# Altium schematic sheet p1_control_block_mcu.SchDoc
size A1; SheetNumber: 1; SheetTotal: 1
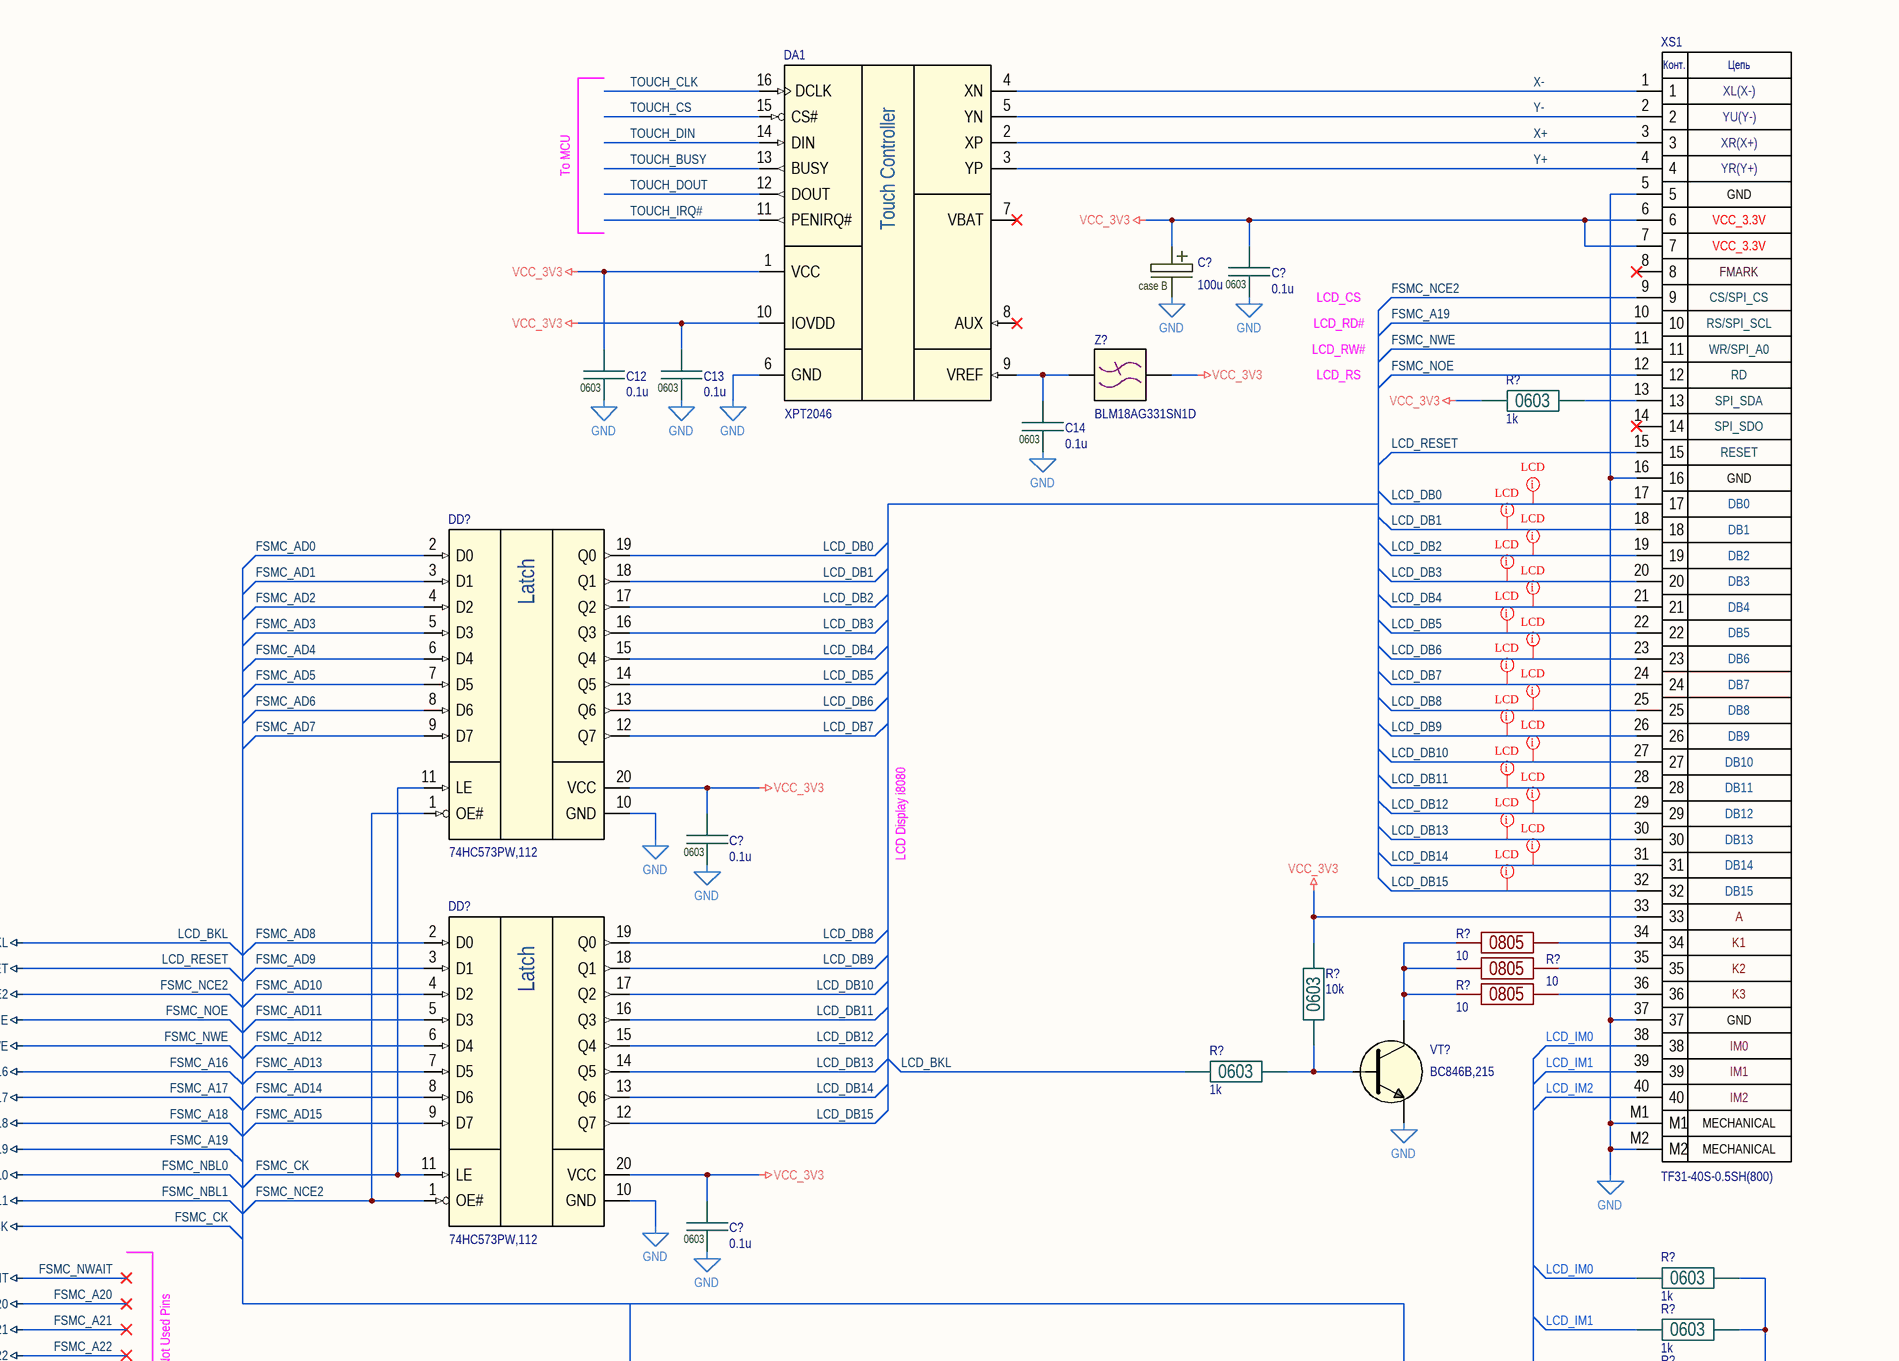
[diagram p0: p1_control_block_mcu.SchDoc, top right]
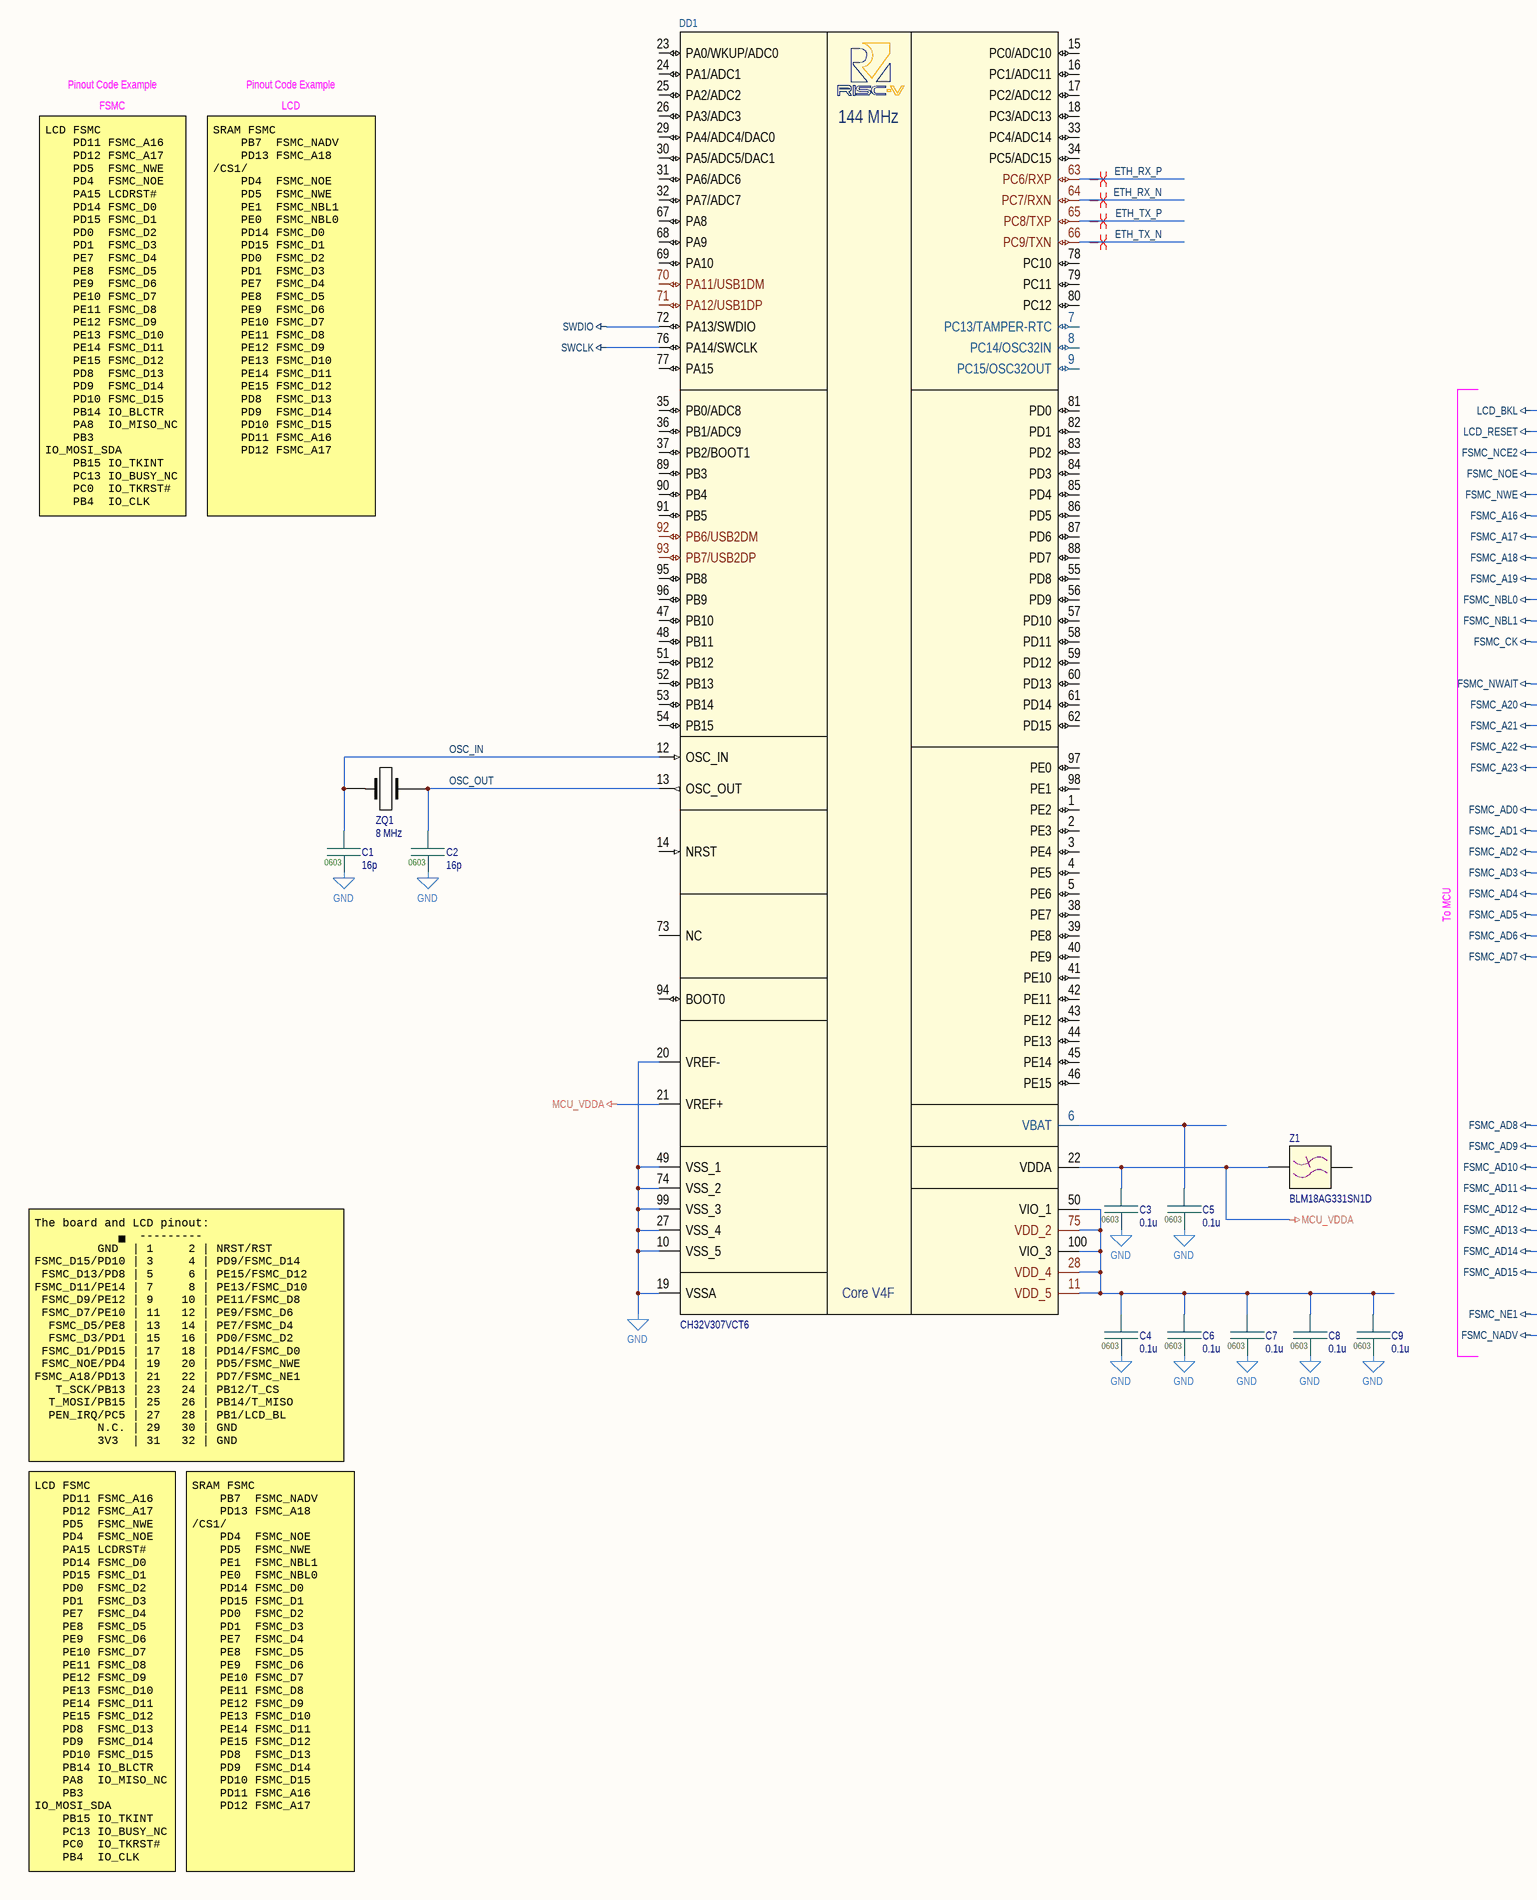
[diagram p1: p1_control_block_mcu.SchDoc, bottom left]
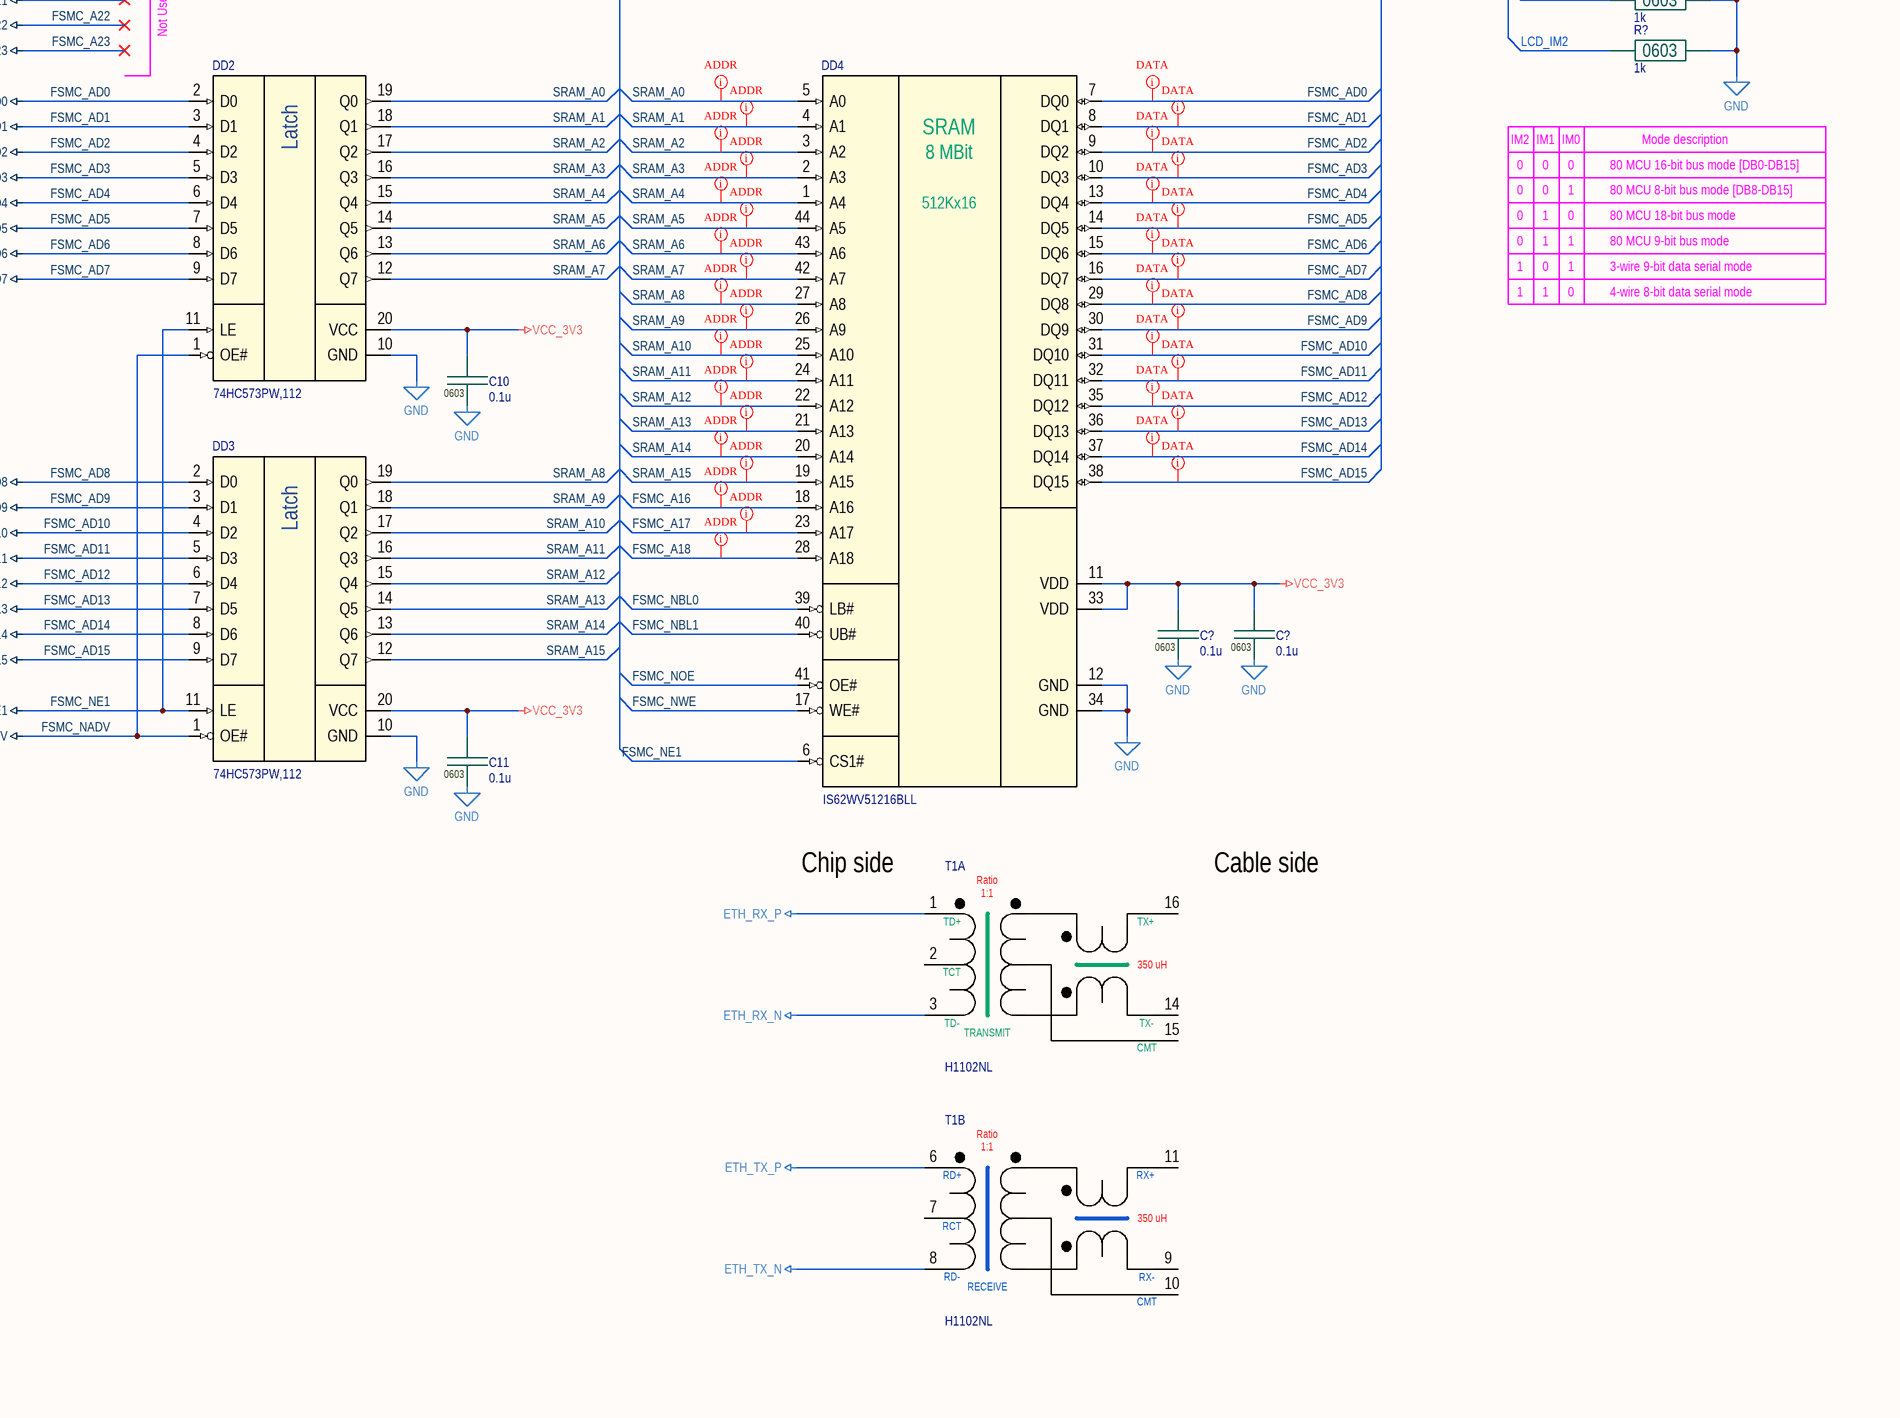
[diagram p2: p1_control_block_mcu.SchDoc, bottom right]

## Parts
(Parts that share a designator on the sheet are numbered #1, #2 ... from top to bottom, then left to right.)
C1  16p  Package: 0603  [CAP0603]
C2  16p  Package: 0603  [CAP0603]
C3  0.1u  Package: 0603  [CAP0603]
C4  0.1u  Package: 0603  [CAP0603]
C5  0.1u  Package: 0603  [CAP0603]
C6  0.1u  Package: 0603  [CAP0603]
C7  0.1u  Package: 0603  [CAP0603]
C8  0.1u  Package: 0603  [CAP0603]
C9  0.1u  Package: 0603  [CAP0603]
C10  0.1u  Package: 0603  [CAP0603]
C11  0.1u  Package: 0603  [CAP0603]
C12  0.1u  Package: 0603  [CAP0603]
C13  0.1u  Package: 0603  [CAP0603]
C14  0.1u  Package: 0603  [CAP0603]
C?#1  100u  Package: case B  [CAP_CASE_B]
C?#2  0.1u  Package: 0603  [CAP0603]
C?#3  0.1u  Package: 0603  [CAP0603]
C?#4  0.1u  Package: 0603  [CAP0603]
C?#5  0.1u  Package: 0603  [CAP0603]
C?#6  0.1u  Package: 0603  [CAP0603]
DA1  XPT2046  [TSSOP-16]
DD1  CH32V307VCT6  [LQFP-100]
DD2  74HC573PW,112  [TSSOP-20]
DD3  74HC573PW,112  [TSSOP-20]
DD4  IS62WV51216BLL  [TSOP-44 II]
DD?#1  74HC573PW,112  [TSSOP-20]
DD?#2  74HC573PW,112  [TSSOP-20]
R?#1  1k  Package: 0603  [RES0603B]
R?#2  10k  Package: 0603  [RES0603B]
R?#3  10  Package: 0805  [RES0805B]
R?#4  10  Package: 0805  [RES0805B]
R?#5  10  Package: 0805  [RES0805B]
R?#6  1k  Package: 0603  [RES0603B]
R?#7  1k  Package: 0603  [RES0603B]
R?#8  1k  Package: 0603  [RES0603B]
R?#9  1k  Package: 0603  [RES0603B]
T1  H1102NL  [H1102NL]  (parts A,B of 2)
VT?  BC846B,215  [SOT23-3]
XS1  TF31-40S-0.5SH(800)  [TF31-40S-0.5SH_With_LCD]
Z1  BLM18AG331SN1D  [BLM0603P]
Z?  BLM18AG331SN1D  [BLM0603P]
ZQ1  Frequency: 8 MHz  [HC-49S]  (hidden comment: SJK-6C-8.000-16-30-50-B-50-H)

## Nets
ETH_RX_N: DD1.64(PC7/RXN) T1.3(TD-)
ETH_RX_P: DD1.63(PC6/RXP) T1.1(TD+)
ETH_TX_N: DD1.66(PC9/TXN) T1.8(RD-)
ETH_TX_P: DD1.65(PC8/TXP) T1.6(RD+)
FSMC_A16: DD4.18(A16)
FSMC_A17: DD4.23(A17)
FSMC_A18: DD4.28(A18)
FSMC_A19: XS1.10
FSMC_AD0: DD2.2(D0) DD4.7(DQ0) DD?#1.2(D0)
FSMC_AD1: DD2.3(D1) DD4.8(DQ1) DD?#1.3(D1)
FSMC_AD2: DD2.4(D2) DD4.9(DQ2) DD?#1.4(D2)
FSMC_AD3: DD2.5(D3) DD4.10(DQ3) DD?#1.5(D3)
FSMC_AD4: DD2.6(D4) DD4.13(DQ4) DD?#1.6(D4)
FSMC_AD5: DD2.7(D5) DD4.14(DQ5) DD?#1.7(D5)
FSMC_AD6: DD2.8(D6) DD4.15(DQ6) DD?#1.8(D6)
FSMC_AD7: DD2.9(D7) DD4.16(DQ7) DD?#1.9(D7)
FSMC_AD8: DD3.2(D0) DD4.29(DQ8) DD?#2.2(D0)
FSMC_AD9: DD3.3(D1) DD4.30(DQ9) DD?#2.3(D1)
FSMC_AD10: DD3.4(D2) DD4.31(DQ10) DD?#2.4(D2)
FSMC_AD11: DD3.5(D3) DD4.32(DQ11) DD?#2.5(D3)
FSMC_AD12: DD3.6(D4) DD4.35(DQ12) DD?#2.6(D4)
FSMC_AD13: DD3.7(D5) DD4.36(DQ13) DD?#2.7(D5)
FSMC_AD14: DD3.8(D6) DD4.37(DQ14) DD?#2.8(D6)
FSMC_AD15: DD3.9(D7) DD4.38(DQ15) DD?#2.9(D7)
FSMC_CK: DD?#1.11(LE) DD?#2.11(LE)
FSMC_NADV: DD2.1(OE#) DD3.1(OE#)
FSMC_NBL0: DD4.39(LB#)
FSMC_NBL1: DD4.40(UB#)
FSMC_NCE2: DD?#1.1(OE#) DD?#2.1(OE#) XS1.9
FSMC_NE1: DD2.11(LE) DD3.11(LE) DD4.6(CS1#)
FSMC_NOE: DD4.41(OE#) XS1.12
FSMC_NWE: DD4.17(WE#) XS1.11
GND: C1.1 C2.1 C3.1 C4.1 C5.1 C6.1 C7.1 C8.1 C9.1 C10.1 C11.1 C12.1 C13.1 C14.1 C?#1.2 C?#2.1 C?#3.1 C?#4.1 C?#5.1 C?#6.1 DA1.6(GND) DD1.10(VSS_5) DD1.19(VSSA) DD1.20(VREF-) DD1.27(VSS_4) DD1.49(VSS_1) DD1.74(VSS_2) DD1.99(VSS_3) DD2.10(GND) DD3.10(GND) DD4.12(GND) DD4.34(GND) DD?#1.10(GND) DD?#2.10(GND) R?#7.2 R?#8.2 R?#9.2 VT?.2(E) XS1.5 XS1.16 XS1.37 XS1.M1 XS1.M2
LCD_BKL: R?#6.1
LCD_RESET: XS1.15
MCU_VDDA: C3.2 DD1.21(VREF+) DD1.22(VDDA) Z1.1
SWCLK: DD1.76(PA14/SWCLK)
SWDIO: DD1.72(PA13/SWDIO)
VCC_3V3: C10.2 C11.2 C12.2 C13.2 C?#1.1 C?#2.2 C?#3.2 C?#4.2 C?#5.2 C?#6.2 DA1.1(VCC) DA1.10(IOVDD) DD2.20(VCC) DD3.20(VCC) DD4.11(VDD) DD4.33(VDD) DD?#1.20(VCC) DD?#2.20(VCC) R?#1.1 R?#2.1 XS1.6 XS1.7 XS1.33 Z?.2
LCD_DB0: DD?#1.19(Q0) XS1.17
LCD_DB1: DD?#1.18(Q1) XS1.18
LCD_DB2: DD?#1.17(Q2) XS1.19
LCD_DB3: DD?#1.16(Q3) XS1.20
LCD_DB4: DD?#1.15(Q4) XS1.21
LCD_DB5: DD?#1.14(Q5) XS1.22
LCD_DB6: DD?#1.13(Q6) XS1.23
LCD_DB7: DD?#1.12(Q7) XS1.24
LCD_DB8: DD?#2.19(Q0) XS1.25
LCD_DB9: DD?#2.18(Q1) XS1.26
LCD_DB10: DD?#2.17(Q2) XS1.27
LCD_DB11: DD?#2.16(Q3) XS1.28
LCD_DB12: DD?#2.15(Q4) XS1.29
LCD_DB13: DD?#2.14(Q5) XS1.30
LCD_DB14: DD?#2.13(Q6) XS1.31
LCD_DB15: DD?#2.12(Q7) XS1.32
LCD_IM0: R?#7.1 XS1.38
LCD_IM1: R?#8.1 XS1.39
LCD_IM2: R?#9.1 XS1.40
OSC_IN: C1.2 DD1.12(OSC_IN) ZQ1.1(XTAL0)
OSC_OUT: C2.2 DD1.13(OSC_OUT) ZQ1.2(XTAL1)
SRAM_A0: DD2.19(Q0) DD4.5(A0)
SRAM_A1: DD2.18(Q1) DD4.4(A1)
SRAM_A2: DD2.17(Q2) DD4.3(A2)
SRAM_A3: DD2.16(Q3) DD4.2(A3)
SRAM_A4: DD2.15(Q4) DD4.1(A4)
SRAM_A5: DD2.14(Q5) DD4.44(A5)
SRAM_A6: DD2.13(Q6) DD4.43(A6)
SRAM_A7: DD2.12(Q7) DD4.42(A7)
SRAM_A8: DD3.19(Q0) DD4.27(A8)
SRAM_A9: DD3.18(Q1) DD4.26(A9)
SRAM_A10: DD3.17(Q2) DD4.25(A10)
SRAM_A11: DD3.16(Q3) DD4.24(A11)
SRAM_A12: DD3.15(Q4) DD4.22(A12)
SRAM_A13: DD3.14(Q5) DD4.21(A13)
SRAM_A14: DD3.13(Q6) DD4.20(A14)
SRAM_A15: DD3.12(Q7) DD4.19(A15)
TOUCH_BUSY: DA1.13(BUSY)
TOUCH_CLK: DA1.16(DCLK)
TOUCH_CS: DA1.15(CS#)
TOUCH_DIN: DA1.14(DIN)
TOUCH_DOUT: DA1.12(DOUT)
TOUCH_IRQ#: DA1.11(PENIRQ#)
X+: DA1.2(XP) XS1.3
X-: DA1.4(XN) XS1.1
Y+: DA1.3(YP) XS1.4
Y-: DA1.5(YN) XS1.2
NetC4_2: C4.2 C6.2 C7.2 C8.2 C9.2 DD1.11(VDD_5) DD1.28(VDD_4) DD1.50(VIO_1) DD1.75(VDD_2) DD1.100(VIO_3)
NetC5_2: C5.2 DD1.6(VBAT)
NetC14_2: C14.2 DA1.9(VREF) Z?.1
NetR?#1_2: R?#1.2 XS1.13
NetR?#2_2: R?#2.2 R?#6.2 VT?.1(B)
NetR?#3_1: R?#3.1 R?#4.1 R?#5.1 VT?.3(C)
NetR?#3_2: R?#3.2 XS1.34
NetR?#4_2: R?#4.2 XS1.35
NetR?#5_2: R?#5.2 XS1.36

Not connected (* = marked no-connect by the designer): DA1 7(VBAT)* 8(AUX)*; DD1 1(PE2) 2(PE3) 3(PE4) 4(PE5) 5(PE6) 7(PC13/TAMPER-RTC) 8(PC14/OSC32IN) 9(PC15/OSC32OUT) 14(NRST) 15(PC0/ADC10) 16(PC1/ADC11) 17(PC2/ADC12) 18(PC3/ADC13) 23(PA0/WKUP/ADC0) 24(PA1/ADC1) 25(PA2/ADC2) 26(PA3/ADC3) 29(PA4/ADC4/DAC0) 30(PA5/ADC5/DAC1) 31(PA6/ADC6) 32(PA7/ADC7) 33(PC4/ADC14) 34(PC5/ADC15) 35(PB0/ADC8) 36(PB1/ADC9) 37(PB2/BOOT1) 38(PE7) 39(PE8) 40(PE9) 41(PE10) 42(PE11) 43(PE12) 44(PE13) 45(PE14) 46(PE15) 47(PB10) 48(PB11) 51(PB12) 52(PB13) 53(PB14) 54(PB15) 55(PD8) 56(PD9) 57(PD10) 58(PD11) 59(PD12) 60(PD13) 61(PD14) 62(PD15) 67(PA8) 68(PA9) 69(PA10) 70(PA11/USB1DM) 71(PA12/USB1DP) 73(NC) 77(PA15) 78(PC10) 79(PC11) 80(PC12) 81(PD0) 82(PD1) 83(PD2) 84(PD3) 85(PD4) 86(PD5) 87(PD6) 88(PD7) 89(PB3) 90(PB4) 91(PB5) 92(PB6/USB2DM) 93(PB7/USB2DP) 94(BOOT0) 95(PB8) 96(PB9) 97(PE0) 98(PE1); T1 2(TCT) 7(RCT) 9(RX-) 10(CMTR) 11(RX+) 14(TX-) 15(CMTT) 16(TX+); XS1 8* 14*; Z1 2

## Layout directives
differential pair; differential pair class ETH: ETH_RX_N, ETH_RX_P, ETH_TX_N, ETH_TX_P
net class LCD; rule Matched Net Lengths [Tolerance = 1mm]: LCD_DB0, LCD_DB1, LCD_DB2, LCD_DB3, LCD_DB4, LCD_DB5, LCD_DB6, LCD_DB7, LCD_DB8, LCD_DB9, LCD_DB10, LCD_DB11, LCD_DB12, LCD_DB13, LCD_DB14, LCD_DB15
net class SRAM_ADDR; rule Matched Net Lengths [Tolerance = 1mm]: FSMC_A16, FSMC_A17, FSMC_A18, SRAM_A0, SRAM_A1, SRAM_A2, SRAM_A3, SRAM_A4, SRAM_A5, SRAM_A6, SRAM_A7, SRAM_A8, SRAM_A9, SRAM_A10, SRAM_A11, SRAM_A12, SRAM_A13, SRAM_A14, SRAM_A15
net class SRAM_DATA; rule Matched Net Lengths [Tolerance = 1mm]: FSMC_AD0, FSMC_AD1, FSMC_AD2, FSMC_AD3, FSMC_AD4, FSMC_AD5, FSMC_AD6, FSMC_AD7, FSMC_AD8, FSMC_AD9, FSMC_AD10, FSMC_AD11, FSMC_AD12, FSMC_AD13, FSMC_AD14, FSMC_AD15

## Notes on the sheet
- XL(X-)
- To MCU
- XR(X+)
- YU(Y-)
- YR(Y+)
- GND
- (near XS1) VCC_3.3V
- LCD_CS
- FMARK
- (near XS1) CS/SPI_CS
- LCD_RD#
- LCD_RW#
- (near XS1) RS/SPI_SCL
- (near XS1) WR/SPI_A0
- LCD_RS
- RD
- SPI_SDA
- SPI_SDO
- RESET
- Pinout Code Example
- DB0
- DB1
- DB2
- FSMC
- LCD
- DB3
- DB4
- DB5
- DB6
- DB7
- DB8
- DB9
- LCD Display i8080
- DB10
- DB11
- DB12
- DB13
- DB14
- DB15
- A
- K1
- K2
- K3
- LCD FSMC
  PD11 FSMC_A16
  PD12 FSMC_A17
  PD5  FSMC_NWE
  PD4  FSMC_NOE
  PA15 LCDRST#
  PD14 FSMC_D0
  PD15 FSMC_D1
  PD0  FSMC_D2
  PD1  FSMC_D3
  PE7  FSMC_D4
  PE8  FSMC_D5
  PE9  FSMC_D6
  PE10 FSMC_D7
  PE11 FSMC_D8
  PE12 FSMC_D9
  PE13 FSMC_D10
  PE14 FSMC_D11
  PE15 FSMC_D12
  PD8  FSMC_D13
  PD9  FSMC_D14
  PD10 FSMC_D15
  PB14 IO_BLCTR
  PA8  IO_MISO_NC
  PB3  IO_MOSI_SDA
  PB15 IO_TKINT
  PC13 IO_BUSY_NC
  PC0  IO_TKRST#
  PB4  IO_CLK
- SRAM FSMC
  PB7  FSMC_NADV
  PD13 FSMC_A18 /CS1/
  PD4  FSMC_NOE
  PD5  FSMC_NWE
  PE1  FSMC_NBL1
  PE0  FSMC_NBL0
  PD14 FSMC_D0
  PD15 FSMC_D1
  PD0  FSMC_D2
  PD1  FSMC_D3
  PE7  FSMC_D4
  PE8  FSMC_D5
  PE9  FSMC_D6
  PE10 FSMC_D7
  PE11 FSMC_D8
  PE12 FSMC_D9
  PE13 FSMC_D10
  PE14 FSMC_D11
  PE15 FSMC_D12
  PD8  FSMC_D13
  PD9  FSMC_D14
  PD10 FSMC_D15
  PD11 FSMC_A16
  PD12 FSMC_A17
- IM0
- IM1
- IM2
- (near XS1) MECHANICAL
- Not Used Pins
- Mode description
- 0
- 1
- 80 MCU 16-bit bus mode [DB0-DB15]
- 80 MCU 8-bit bus mode [DB8-DB15]
- 80 MCU 18-bit bus mode
- 80 MCU 9-bit bus mode
- 3-wire 9-bit data serial mode
- 4-wire 8-bit data serial mode
- The board and LCD pinout:
  ▄  ---------
  GND  | 1     2 | NRST/RST
  FSMC_D15/PD10 | 3     4 | PD9/FSMC_D14
  FSMC_D13/PD8 | 5     6 | PE15/FSMC_D12
  FSMC_D11/PE14 | 7     8 | PE13/FSMC_D10
  FSMC_D9/PE12 | 9    10 | PE11/FSMC_D8
  FSMC_D7/PE10 | 11   12 | PE9/FSMC_D6
  FSMC_D5/PE8 | 13   14 | PE7/FSMC_D4
  FSMC_D3/PD1 | 15   16 | PD0/FSMC_D2
  FSMC_D1/PD15 | 17   18 | PD14/FSMC_D0
  FSMC_NOE/PD4 | 19   20 | PD5/FSMC_NWE
  FSMC_A18/PD13 | 21   22 | PD7/FSMC_NE1
  T_SCK/PB13 | 23   24 | PB12/T_CS
  T_MOSI/PB15 | 25   26 | PB14/T_MISO
  PEN_IRQ/PC5 | 27   28 | PB1/LCD_BL
  N.C. | 29   30 | GND
  3V3  | 31   32 | GND
- Chip side
- Cable side
- (in symbol 74HC573PW,112) Latch
- (in symbol CH32V307VCT6) 144 MHz; Core V4F
- (in symbol H1102NL, part A) Ratio; 1:1; 350 uH; TRANSMIT; CMT
- (in symbol H1102NL, part B) Ratio; 1:1; 350 uH; RECEIVE; CMT
- (in symbol IS62WV51216BLL) SRAM; 8 MBit; 512Kx16
- (in symbol TF31-40S-0.5SH(800)) Конт.; Цепь
- (in symbol XPT2046) Touch Controller

## Library data of the parts
C1 C2 = C0603: Capacitors 0603 package case; Part Number: CL10C160JB8NNNC; Manufacturer: Samsung; Tolerance: ± 5 %; Dielectric: NP0; Voltage: 50V; Value: 16p; Value on schem: 16p
C3-C14 C?#2-C?#6 = C0603: Capacitors 0603 package case; Part Number: CL10B104KB8NNNC; Manufacturer: Samsung; Tolerance: ± 10 %; Dielectric: X7R; Voltage: 50V; Value: 0.1u; Value on schem: 0.1u
C?#1 = C_CASEB: Tantalum capacitors case B; Part Number: 293D107X0010B2TE3; Manufacturer: Vishay Intertechnology Inc.; Tolerance: ± 10 %; Voltage: 10V; ESR: 2.5Ohm @ 100 kHz; Value: 100u; Value on schem: 100u; Series: 293D
DA1 = XPT2046: Touch Screen Controller; Manufacturer: XPTEK Tech; Package: TSSOP-16; Part Number: XPT2046
DD1 = CH32V307VCT6: RISC-V MCU 144MHz with 256KB flash, 64KB RAM; Manufacturer: WinChipHead; Package: LQFP-100; Part Number: CH32V307VCT6
DD2 DD3 DD?#1 DD?#2 = 74HC573PW,112: Octal D-type transparent latch; 3-state; Manufacturer: NXP USA Inc.; Package: TSSOP-16; Part Number: 74HC573PW,112
DD4 = IS62WV51216BLL: 512K X 16 Low Voltage, Ultra Low Power CMOS Static SRAM; Manufacturer: ISSI, Integrated Silicon Solution Inc; Access Time: 55ns; Package: TSOP-44 II; Part Number: IS62WV51216BLL
R?#1 R?#6-R?#9 = R0603: Resistor 0603 package case; Part Number: RC0603FR-071KL; Manufacturer: Yageo; Tolerance: ± 1 %; Temperature coefficient: ± 100 ppm/°C; Voltage: 75V; Value: 1k; Value on schem: 1k
R?#2 = R0603: Resistor 0603 package case; Part Number: RC0603FR-0710KL; Manufacturer: Yageo; Tolerance: ± 1 %; Temperature coefficient: ± 100 ppm/°C; Voltage: 75V; Value: 10k; Value on schem: 10k
R?#3-R?#5 = R0805: Resistor 0805 package case; Part Number: RC0603FR-0710RL; Manufacturer: 0603; Tolerance: ± 1 %; Voltage: 75V; Temperature Coefficient: ±100 ppm/°C; Value: 10; Value on schem: 10
T1 = H1102NL: 10/100BASE-T Ethernet transformer Ratio 1:1 350 uH; Manufacturer: Pulse Electronics; Part Number: H1102NL
VT? = BC846B,215: General Purpose n-p-n Transistors; Manufacturer: Nexperia USA Inc.; Package: SOT23-3; Part Number: BC846B,215
XS1 = TF31-40S-0.5SH(800): 0.5mm Pitch, Flexible Flat Cable ZIF Connectors; Manufacturer: Hirose Electric Co Ltd.; Part Number: TF31-40S-0.5SH(800)
Z1 Z? = BLM18AG331SN1D: Power line filter, imperdance 330 Ohm (current 05A); Part Number: BLM18AG331SN1D; Package: 0603
ZQ1 = HC-49: Crystal resonator; Manufacturer: SJK; Frequency Tolerance: ±30ppm; Load Capacitance: 16 pF; Package: HC-49; Part Number: SJK-6C-8.000-16-30-50-B-50-H